# Altium schematic sheet Gas_Sampler-Motor.SchDoc: Pump Motor
size Tabloid; Organization: Sensible Robotics LLC; Address1: 120 E Church Ave Suite B; Address2: Ridgecrest CA, 93555; Revision: 0; SheetNumber: 11; SheetTotal: 12; ApprovedBy: Approved Name; Engineer: Mike Licitra; PageSetup: Record=PageOptions|CenterHorizontal=True|CenterVertical=True|PrintScale=0.98|XCorrection=1.00|YCorrection=1.00|PrintKind=0|BorderSize=5000000|LeftOffset=0|BottomOffset=0|Orientation=2|PaperLength=1000|PaperWidth=1000|Scale=100|PaperSource=15|PrintQuality=600|MediaType=1|DitherType=10|PaperKind=Tabloid|PrintScaleMode=1
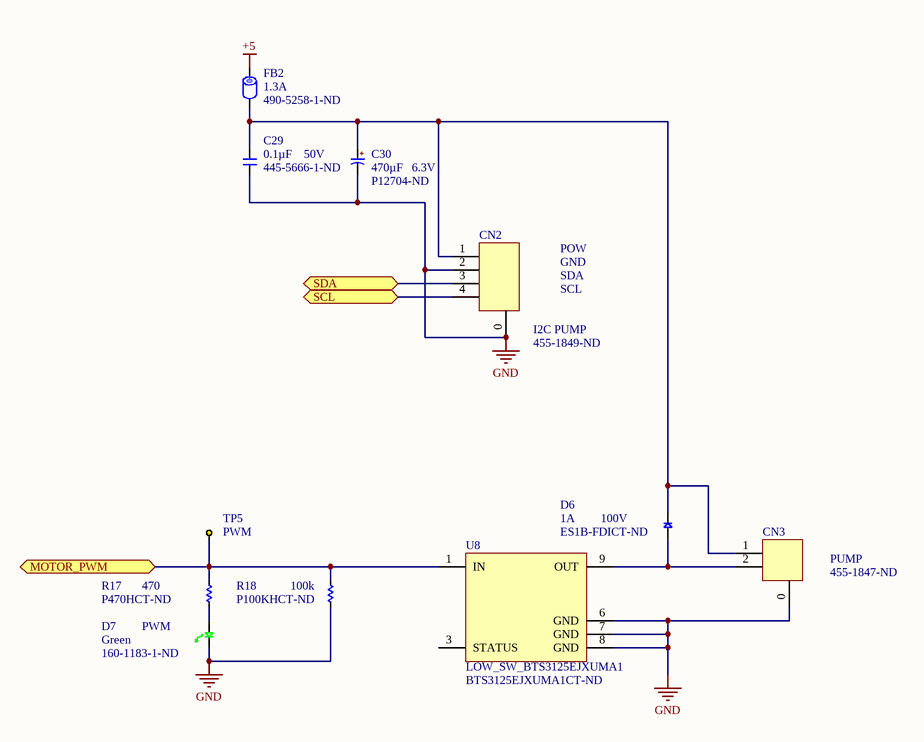
[diagram p0: Gas_Sampler-Motor.SchDoc]

## Parts
C29  value 0.1µF  Voltage - Rated: 50V  Supplier Part Number 1: 445-5666-1-ND  [C0603]  (hidden comment: CAP_CER_0603_0.1UF_50V_10%_X7R)
C30  value 470µF  Voltage - Rated: 6.3V  Supplier Part Number 1: P12704-ND  [CAP_RADIAL_8MM_DIA_11.5MM_LEN_3.5MM_LEADSPACE]  (hidden comment: CAP_ALUM_470UF_6.3V_20%_RADIAL_8X11.5MM)
CN2  I2C PUMP  Supplier Part Number 1: 455-1849-ND  [JST_PA_S04B-PASK-2]
CN3  PUMP  Supplier Part Number 1: 455-1847-ND  [JST_PA_S02B-PASK-2]
D6  Voltage - DC Reverse (Vr) (Max): 100V  Current - Average Rectified (Io): 1A  Supplier Part Number 1: ES1B-FDICT-ND  [SMA]  (hidden comment: DIODE_ES1B-FDICT-ND)
D7  PWM  Color: Green  Supplier Part Number 1: 160-1183-1-ND  [LED_0603_GREEN]
FB2  Current Rating (Max): 1.3A  Supplier Part Number 1: 490-5258-1-ND  [R0603]  (hidden comment: FERRITE_BEAD_0603_1.3A_600_OHM)
R17  value 470  Supplier Part Number 1: P470HCT-ND  [R0603]  (hidden comment: RES_0603_470_OHM_1/10W_1%)
R18  value 100k  Supplier Part Number 1: P100KHCT-ND  [R0603]  (hidden comment: RES_0603_100K_OHM_1/10W_1%)
TP5  PWM  [TP_KEYSTONE_5001]
U8  LOW_SW_BTS3125EJXUMA1  Supplier Part Number 1: BTS3125EJXUMA1CT-ND  [8SOIC150E]

## Ports
MOTOR_PWM, SCL, SDA

## Nets
+5: FB2.1
GND: C29.2 C30.2 CN2.0(CHAS) CN2.2 CN3.0(CHAS) D7.2(CATHODE) R18.1 U8.6(GND) U8.7(GND) U8.8(GND)
MOTOR_PWM: R17.2 R18.2 TP5.1 U8.1(IN) ; port MOTOR_PWM
SCL: CN2.4 ; port SCL
SDA: CN2.3 ; port SDA
NetC29_1: C29.1 C30.1 CN2.1 CN3.1 D6.2 FB2.2
NetCN3_2: CN3.2 D6.1 U8.9(OUT)
NetD7_1: D7.1(ANODE) R17.1

Not connected (* = marked no-connect by the designer): U8 3(STATUS)

## Notes on the sheet
- POW
- GND
- SDA
- SCL
- CONFIDENTIAL DOCUMENT
- DUPLICATION PROHIBITED
- ENGINEER
- PCB FAB #
- SCH #
- REV
- Sensible
- Robotics
- THIS DOCUMENT CONTAINS INFORMATION AND OR DATA, WHICH IS PROPRIETARY AND CONFIDENTIAL TO SENSIBLE ROBOTICS LLC.  THIS INFORMATION AND OR DATA, IS TO BE USED ONLY FOR THE BENEFIT OF THE SUPPLIER, AND IS NOT TO BE USED FOR THE BENEFIT OF OTHER PARTIES WITHOUT WRITTEN CONSENT.
- DATE
- PCB ASSY #
- SIZE
- Tabloid
- SHEET
- OF
- FILE
- (in symbol CAP_ALUM_470UF_6.3V_20%_RADIAL_8X11.5MM) +

## Library data of the parts
C29 = CAP_CER_0603_0.1UF_50V_10%_X7R: CAP CER 0.1UF 50V 10% X7R 0603; Manufacturer: TDK Corporation; Manufacturer Part Number: CGA3E2X7R1H104K080AA; Part Number: 150-00077-00; Supplier 1: Digi-Key; RoHS: RoHS Compliant; Category: Capacitors; Stock 1: 320000; Pricing 1: 1=0.1, 10=0.072, 100=0.033, 250=0.027, 500=0.0231, 1000=0.018 (USD); Packaging: Cut Tape (CT); Tolerance: ±10%; Temperature Coefficient: X7R; Mounting Type: Surface Mount, MLCC; Operating Temperature: -55°C ~ 125°C; Applications: Automotive; Ratings: AEC-Q200; Package / Case: 0603 (1608 Metric); Size / Dimension: 0.063" L x 0.031" W (1.60mm x 0.80mm); Height - Seated (Max): -; Thickness (Max): 0.035" (0.90mm); Lead Spacing: -; Features: -; Lead Style: -; ComponentLink1URL: http://product.tdk.com/capacitor/mlcc/en/documents/mlcc_automotive_general_en.pdf; ComponentLink1Description: http://product.tdk.com/capacitor/mlcc/en/documents/mlcc_automotive_general_en.pdf
C30 = CAP_ALUM_470UF_6.3V_20%_RADIAL_8X11.5MM: CAP ALUM 470UF 6.3V 20% RADIAL; Manufacturer: Panasonic Electronic Components; Manufacturer Part Number: EEU-FC0J471; Part Number: 150-00053-00; Lifetime @ Temp.: 2000 Hrs @ 105°C; Ripple Current: 555mA; Impedance: 117 mOhm; Supplier 1: Digi-Key; RoHS: RoHS Compliant; Category: Capacitors; Stock 1: 89301; Pricing 1: 1=0.48, 50=0.2352, 100=0.2016, 500=0.1512, 1000=0.12768, 5000=0.11424, 10000=0.10752, 25000=0.1008 (USD); Packaging: Bulk; Tolerance: ±20%; Operating Temperature: -55°C ~ 105°C; Features: General Purpose; ESR (Equivalent Series Resistance): -; Mounting Type: Through Hole; Package / Case: Radial, Can; Size / Dimension: 0.315" Dia (8.00mm); Height - Seated (Max): 0.453" (11.50mm); Lead Spacing: 0.138" (3.50mm); Surface Mount Land Size: -; ComponentLink1URL: http://industrial.panasonic.com/www-cgi/jvcr13pz.cgi?E+PZ+3+ABA0022+EEUFC0J471+7+WW; ComponentLink1Description: http://industrial.panasonic.com/www-cgi/jvcr13pz.cgi?E+PZ+3+ABA0022+EEUFC0J471+7+WW
CN2 = JST_PA_RA_TH_GUIDE_4POS: CONN HEADER PA 4POS SIDE 2MM TIN; Manufacturer: JST Sales America Inc.; Manufacturer Part Number: S04B-PASK-2(LF)(SN); Connector Type: Header, Shrouded; Number of Positions: 4; Number of Positions Loaded: All; Pitch: 0.079" (2.00mm); Supplier 1: Digi-Key; Packaging: Bulk; Contact Type: Male Pin; Contact Mating Length: 0.126" (3.20mm); Mounting Type: Through Hole, Right Angle; Termination: Kinked Pin, Solder; Fastening Type: Locking Ramp; Features: Board Guide; Contact Finish: Tin; ComponentLink1URL: http://www.jst-mfg.com/product/pdf/eng/ePA-F.pdf; ComponentLink1Description: http://www.jst-mfg.com/product/pdf/eng/ePA-F.pdf
CN3 = JST_PA_RA_TH_GUIDE_2POS: CONN HEADER PA 2POS SIDE 2MM TIN; Manufacturer: JST Sales America Inc.; Manufacturer Part Number: S02B-PASK-2(LF)(SN); Connector Type: Header, Shrouded; Number of Positions: 2; Number of Positions Loaded: All; Pitch: 0.079" (2.00mm); Supplier 1: Digi-Key; Packaging: Bulk; Contact Type: Male Pin; Contact Mating Length: 0.126" (3.20mm); Mounting Type: Through Hole, Right Angle; Termination: Kinked Pin, Solder; Fastening Type: Locking Ramp; Features: Board Guide; Contact Finish: Tin; ComponentLink1URL: http://www.jst-mfg.com/product/pdf/eng/ePA-F.pdf; ComponentLink1Description: http://www.jst-mfg.com/product/pdf/eng/ePA-F.pdf
D6 = DIODE_ES1B-FDICT-ND: DIODE SUPER FAST 100V 1A SMA; Manufacturer: Diodes Inc; Manufacturer Part Number: ES1B-13-F; Diode Type: Standard; Voltage - Forward (Vf) (Max) @ If: 920mV @ 1A; Speed: Fast Recovery =< 500ns, > 200mA (Io); Reverse Recovery Time (trr): 25ns; Current - Reverse Leakage @ Vr: 5µA @ 100V; Capacitance @ Vr, F: 10pF @ 4V, 1MHz; Supplier 1: Digi-Key; RoHS: RoHS Compliant; Category: Discrete Semiconductor Products; Packaging: Cut Tape (CT); Mounting Type: Surface Mount; Package / Case: DO-214AC, SMA; Supplier Device Package: SMA; ComponentLink1URL: http://www.diodes.com/datasheets/ds14001.pdf; ComponentLink1Description: http://www.diodes.com/datasheets/ds14001.pdf
D7 = LED_0603_GREEN_LG_LTST-C190GKT: LED GREEN CLEAR 0603 SMD; Manufacturer: Lite-On Inc; Millicandela Rating: 6mcd; Wavelength - Dominant: 569nm; Wavelength - Peak: 565nm; Viewing Angle: 130°; Lens Style/Size: Rectangle with Flat Top, 1.1mm x 0.8mm; Voltage - Forward (Vf) Typ: 2.1V; Current - Test: 10mA; Supplier 1: Digi-Key; Manufacturer Part Number: LTST-C190GKT; Lens Type: Clear; Package / Case: 0603 (1608 Metric); Size / Dimension: 1.60mm L x 0.80mm W; Height: 0.80mm; Mounting Type: Surface Mount; Packaging: Cut Tape (CT); ComponentLink1URL: http://media.digikey.com/pdf/Data%20Sheets/Lite-On%20PDFs/LTST-C190GKT.pdf; ComponentLink1Description: Datasheet
FB2 = FERRITE_BEAD_0603_1.3A_600_OHM: FERRITE BEAD 600 OHM 0603 1LN; Manufacturer: Murata Electronics North America; Manufacturer Part Number: BLM18KG601SN1D; Filter Type: Power Line; Number of Lines: 1; Impedance @ Frequency: 600 Ohm @ 100MHz; DC Resistance (DCR) (Max): 150 mOhm; Supplier 1: Digi-Key; RoHS: RoHS Compliant; Category: Filters; Stock 1: 300163; Packaging: Cut Tape (CT); Operating Temperature: -55°C ~ 125°C; Package / Case: 0603 (1608 Metric); Mounting Type: Surface Mount; Height (Max): 0.037" (0.95mm); Size / Dimension: 0.063" L x 0.032" W (1.60mm x 0.80mm); ComponentLink1URL: http://media.digikey.com/pdf/Data%20Sheets/Murata%20PDFs/BLM18yyyyyyN1x.pdf; ComponentLink1Description: http://media.digikey.com/pdf/Data%20Sheets/Murata%20PDFs/BLM18yyyyyyN1x.pdf
R17 = RES_0603_470_OHM_1/10W_1%: RES 470 OHM 1/10W 1% 0603 SMD; Manufacturer: Panasonic Electronic Components; Manufacturer Part Number: ERJ-3EKF4700V; Part Number: 470-00157-00; Power (Watts): 0.1W, 1/10W; Temperature Coefficient: ±100ppm/°C; Supplier 1: Digi-Key; RoHS: RoHS Compliant; Category: Resistors; Stock 1: 212428; Pricing 1: 1=0.1, 50=0.0138, 100=0.0105, 250=0.0078, 500=0.00576, 1000=0.00384 (USD); Packaging: Cut Tape (CT); Composition: Thick Film; Features: -; Tolerance: ±1%; Package / Case: 0603 (1608 Metric); Supplier Device Package: 0603; Size / Dimension: 0.063" L x 0.031" W (1.60mm x 0.80mm); Height: 0.022" (0.55mm); Number of Terminations: 2; ComponentLink1URL: http://industrial.panasonic.com/www-cgi/jvcr13pz.cgi?E+PZ+3+AOA0002+ERJ3EKF4700V+7+WW; ComponentLink1Description: http://industrial.panasonic.com/www-cgi/jvcr13pz.cgi?E+PZ+3+AOA0002+ERJ3EKF4700V+7+WW
R18 = RES_0603_100K_OHM_1/10W_1%: RES 100K OHM 1/10W 1% 0603 SMD; Manufacturer: Panasonic Electronic Components; Manufacturer Part Number: ERJ-3EKF1003V; Power (Watts): 0.1W, 1/10W; Temperature Coefficient: ±100ppm/°C; Supplier 1: Digi-Key; RoHS: RoHS Compliant; Packaging: Cut Tape (CT); Composition: Thick Film; Features: -; Tolerance: ±1%; Package / Case: 0603 (1608 Metric); Supplier Device Package: 0603; Size / Dimension: 0.063" L x 0.031" W (1.60mm x 0.80mm); Height: 0.022" (0.55mm); Number of Terminations: 2; ComponentLink1URL: http://industrial.panasonic.com/www-cgi/jvcr13pz.cgi?E+PZ+3+AOA0002+ERJ3EKF1003V+7+WW; ComponentLink1Description: http://industrial.panasonic.com/www-cgi/jvcr13pz.cgi?E+PZ+3+AOA0002+ERJ3EKF1003V+7+WW
TP5 = TEST_KEYSTONE5001: PC TEST POINT TH RING; Manufacturer: Keystone Electronics; Manufacturer Part Number: 5001; Part Number: 250-00184-00; Supplier 1: Digi-Key; Supplier Part Number 1: 5001K-ND; RoHS: RoHS Compliant; Category: Test and Measurement; Stock 1: 341830; Pricing 1: 1=0.33, 10=0.309, 50=0.2252, 100=0.2164, 250=0.19432, 500=0.18548, 1000=0.15456, 2500=0.14131, 5000=0.13248 (USD); Packaging: Bulk; Type: PC Test Point, Miniature; Terminal: 0.010" x 0.020" (0.25mm x 0.51mm) Phosphor Bronze Wire, Silver Plate; Mounting Type: 0.040" (1.02mm) Hole Diameter; Material: Base, Nylon 46, UL 94V-0; Color: Black; ComponentLink1URL: http://www.keyelco.com/product-pdf.cfm?p=1310; ComponentLink1Description: http://www.keyelco.com/product-pdf.cfm?p=1310
U8 = LOW_SW_BTS3125EJXUMA1: IC PWR SWITCH N-CHAN 1:1 TDSO-8; Manufacturer: Infineon Technologies; Voltage - Load: 31V Max; Output Configuration: Low Side; Supplier 1: Digi-Key; Manufacturer Part Number: BTS3125EJXUMA1; Packaging: Cut Tape (CT); Operating Temperature: -40°C ~ 150°C (TJ); Package / Case: 8-SOIC (0.154", 3.90mm Width) Exposed Pad; Supplier Device Package: PG-TDSO-8-31; ComponentLink1URL: https://www.infineon.com/dgdl/Infineon-BTS3125EJ-DS-v01_00-EN.pdf; ComponentLink1Description: Datasheet